# Altium schematic sheet Crosspoint.SchDoc: Cross-point
size A3; Author: M.Beldyga; CompanyName: WUT ISE; DrawnBy: M.Beldyga; Organization: WUT ISE; Address1: PW ISE; Address2: Nowowiejska 15/19 00-665 Warsaw; Address3: micbeldyga@gmail.com; SheetNumber: 2; SheetTotal: 8; ModifiedBy: -; CheckedDate: -; DivGrp: WUT ISE; Designer: M.Beldyga; ModifiedDate: -; ProjectName: Sensor Box
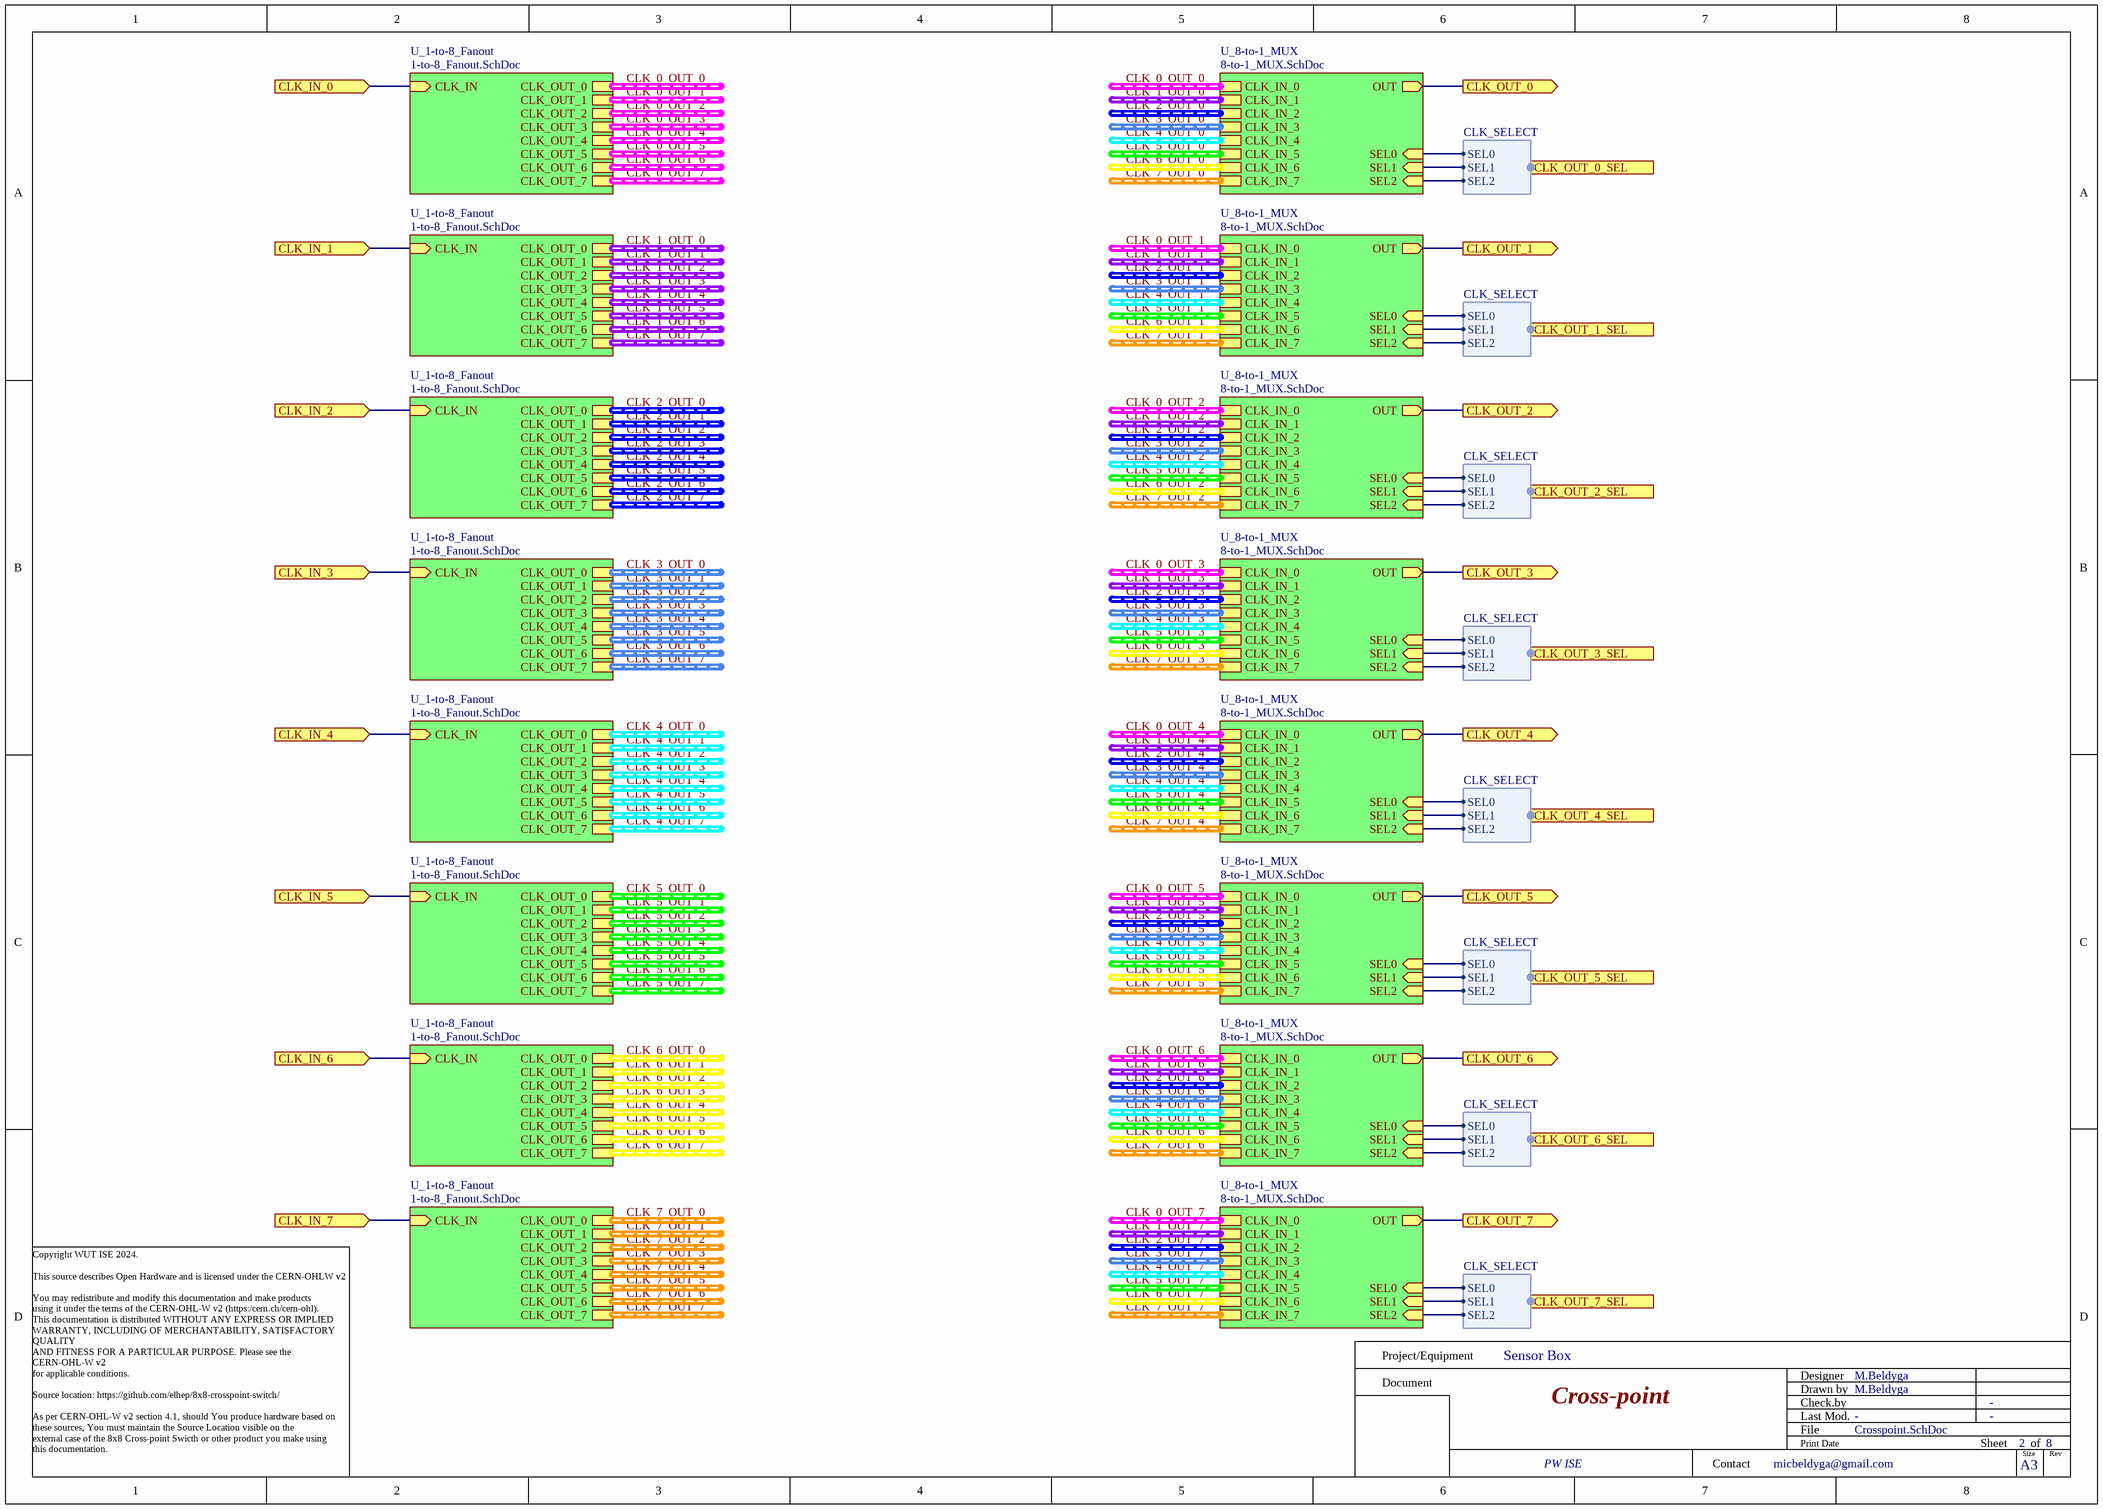
[diagram p0: Crosspoint.SchDoc]

## Sub-sheets
U_1-to-8_Fanout = 1-to-8_Fanout.SchDoc: CLK_IN (in), CLK_OUT_0 (harness DIFF_CLK), CLK_OUT_1 (harness DIFF_CLK), CLK_OUT_2 (harness DIFF_CLK), CLK_OUT_3 (harness DIFF_CLK), CLK_OUT_4 (harness DIFF_CLK), CLK_OUT_5 (harness DIFF_CLK), CLK_OUT_6 (harness DIFF_CLK), CLK_OUT_7 (harness DIFF_CLK)
U_1-to-8_Fanout = 1-to-8_Fanout.SchDoc: CLK_IN (in), CLK_OUT_0 (harness DIFF_CLK), CLK_OUT_1 (harness DIFF_CLK), CLK_OUT_2 (harness DIFF_CLK), CLK_OUT_3 (harness DIFF_CLK), CLK_OUT_4 (harness DIFF_CLK), CLK_OUT_5 (harness DIFF_CLK), CLK_OUT_6 (harness DIFF_CLK), CLK_OUT_7 (harness DIFF_CLK)
U_1-to-8_Fanout = 1-to-8_Fanout.SchDoc: CLK_IN (in), CLK_OUT_0 (harness DIFF_CLK), CLK_OUT_1 (harness DIFF_CLK), CLK_OUT_2 (harness DIFF_CLK), CLK_OUT_3 (harness DIFF_CLK), CLK_OUT_4 (harness DIFF_CLK), CLK_OUT_5 (harness DIFF_CLK), CLK_OUT_6 (harness DIFF_CLK), CLK_OUT_7 (harness DIFF_CLK)
U_1-to-8_Fanout = 1-to-8_Fanout.SchDoc: CLK_IN (in), CLK_OUT_0 (harness DIFF_CLK), CLK_OUT_1 (harness DIFF_CLK), CLK_OUT_2 (harness DIFF_CLK), CLK_OUT_3 (harness DIFF_CLK), CLK_OUT_4 (harness DIFF_CLK), CLK_OUT_5 (harness DIFF_CLK), CLK_OUT_6 (harness DIFF_CLK), CLK_OUT_7 (harness DIFF_CLK)
U_1-to-8_Fanout = 1-to-8_Fanout.SchDoc: CLK_IN (in), CLK_OUT_0 (harness DIFF_CLK), CLK_OUT_1 (harness DIFF_CLK), CLK_OUT_2 (harness DIFF_CLK), CLK_OUT_3 (harness DIFF_CLK), CLK_OUT_4 (harness DIFF_CLK), CLK_OUT_5 (harness DIFF_CLK), CLK_OUT_6 (harness DIFF_CLK), CLK_OUT_7 (harness DIFF_CLK)
U_1-to-8_Fanout = 1-to-8_Fanout.SchDoc: CLK_IN (in), CLK_OUT_0 (harness DIFF_CLK), CLK_OUT_1 (harness DIFF_CLK), CLK_OUT_2 (harness DIFF_CLK), CLK_OUT_3 (harness DIFF_CLK), CLK_OUT_4 (harness DIFF_CLK), CLK_OUT_5 (harness DIFF_CLK), CLK_OUT_6 (harness DIFF_CLK), CLK_OUT_7 (harness DIFF_CLK)
U_1-to-8_Fanout = 1-to-8_Fanout.SchDoc: CLK_IN (in), CLK_OUT_0 (harness DIFF_CLK), CLK_OUT_1 (harness DIFF_CLK), CLK_OUT_2 (harness DIFF_CLK), CLK_OUT_3 (harness DIFF_CLK), CLK_OUT_4 (harness DIFF_CLK), CLK_OUT_5 (harness DIFF_CLK), CLK_OUT_6 (harness DIFF_CLK), CLK_OUT_7 (harness DIFF_CLK)
U_1-to-8_Fanout = 1-to-8_Fanout.SchDoc: CLK_IN (in), CLK_OUT_0 (harness DIFF_CLK), CLK_OUT_1 (harness DIFF_CLK), CLK_OUT_2 (harness DIFF_CLK), CLK_OUT_3 (harness DIFF_CLK), CLK_OUT_4 (harness DIFF_CLK), CLK_OUT_5 (harness DIFF_CLK), CLK_OUT_6 (harness DIFF_CLK), CLK_OUT_7 (harness DIFF_CLK)
U_8-to-1_MUX = 8-to-1_MUX.SchDoc: SEL1 (in), SEL2 (in), SEL0 (in), OUT (out), CLK_IN_0 (harness DIFF_CLK), CLK_IN_1 (harness DIFF_CLK), CLK_IN_2 (harness DIFF_CLK), CLK_IN_3 (harness DIFF_CLK), CLK_IN_4 (harness DIFF_CLK), CLK_IN_5 (harness DIFF_CLK), CLK_IN_6 (harness DIFF_CLK), CLK_IN_7 (harness DIFF_CLK)
U_8-to-1_MUX = 8-to-1_MUX.SchDoc: SEL1 (in), SEL2 (in), SEL0 (in), OUT (out), CLK_IN_0 (harness DIFF_CLK), CLK_IN_1 (harness DIFF_CLK), CLK_IN_2 (harness DIFF_CLK), CLK_IN_3 (harness DIFF_CLK), CLK_IN_4 (harness DIFF_CLK), CLK_IN_5 (harness DIFF_CLK), CLK_IN_6 (harness DIFF_CLK), CLK_IN_7 (harness DIFF_CLK)
U_8-to-1_MUX = 8-to-1_MUX.SchDoc: SEL1 (in), SEL2 (in), SEL0 (in), OUT (out), CLK_IN_0 (harness DIFF_CLK), CLK_IN_1 (harness DIFF_CLK), CLK_IN_2 (harness DIFF_CLK), CLK_IN_3 (harness DIFF_CLK), CLK_IN_4 (harness DIFF_CLK), CLK_IN_5 (harness DIFF_CLK), CLK_IN_6 (harness DIFF_CLK), CLK_IN_7 (harness DIFF_CLK)
U_8-to-1_MUX = 8-to-1_MUX.SchDoc: SEL1 (in), SEL2 (in), SEL0 (in), OUT (out), CLK_IN_0 (harness DIFF_CLK), CLK_IN_1 (harness DIFF_CLK), CLK_IN_2 (harness DIFF_CLK), CLK_IN_3 (harness DIFF_CLK), CLK_IN_4 (harness DIFF_CLK), CLK_IN_5 (harness DIFF_CLK), CLK_IN_6 (harness DIFF_CLK), CLK_IN_7 (harness DIFF_CLK)
U_8-to-1_MUX = 8-to-1_MUX.SchDoc: SEL1 (in), SEL2 (in), SEL0 (in), OUT (out), CLK_IN_0 (harness DIFF_CLK), CLK_IN_1 (harness DIFF_CLK), CLK_IN_2 (harness DIFF_CLK), CLK_IN_3 (harness DIFF_CLK), CLK_IN_4 (harness DIFF_CLK), CLK_IN_5 (harness DIFF_CLK), CLK_IN_6 (harness DIFF_CLK), CLK_IN_7 (harness DIFF_CLK)
U_8-to-1_MUX = 8-to-1_MUX.SchDoc: SEL1 (in), SEL2 (in), SEL0 (in), OUT (out), CLK_IN_0 (harness DIFF_CLK), CLK_IN_1 (harness DIFF_CLK), CLK_IN_2 (harness DIFF_CLK), CLK_IN_3 (harness DIFF_CLK), CLK_IN_4 (harness DIFF_CLK), CLK_IN_5 (harness DIFF_CLK), CLK_IN_6 (harness DIFF_CLK), CLK_IN_7 (harness DIFF_CLK)
U_8-to-1_MUX = 8-to-1_MUX.SchDoc: SEL1 (in), SEL2 (in), SEL0 (in), OUT (out), CLK_IN_0 (harness DIFF_CLK), CLK_IN_1 (harness DIFF_CLK), CLK_IN_2 (harness DIFF_CLK), CLK_IN_3 (harness DIFF_CLK), CLK_IN_4 (harness DIFF_CLK), CLK_IN_5 (harness DIFF_CLK), CLK_IN_6 (harness DIFF_CLK), CLK_IN_7 (harness DIFF_CLK)
U_8-to-1_MUX = 8-to-1_MUX.SchDoc: SEL1 (in), SEL2 (in), SEL0 (in), OUT (out), CLK_IN_0 (harness DIFF_CLK), CLK_IN_1 (harness DIFF_CLK), CLK_IN_2 (harness DIFF_CLK), CLK_IN_3 (harness DIFF_CLK), CLK_IN_4 (harness DIFF_CLK), CLK_IN_5 (harness DIFF_CLK), CLK_IN_6 (harness DIFF_CLK), CLK_IN_7 (harness DIFF_CLK)

## Ports
CLK_IN_0 (in), CLK_IN_1 (in), CLK_IN_2 (in), CLK_IN_3 (in), CLK_IN_4 (in), CLK_IN_5 (in), CLK_IN_6 (in), CLK_IN_7 (in), CLK_OUT_0 (out), CLK_OUT_0_SEL (out, harness CLK_SELECT), CLK_OUT_1 (out), CLK_OUT_1_SEL (out, harness CLK_SELECT), CLK_OUT_2 (out), CLK_OUT_2_SEL (out, harness CLK_SELECT), CLK_OUT_3 (out), CLK_OUT_3_SEL (out, harness CLK_SELECT), CLK_OUT_4 (out), CLK_OUT_4_SEL (out, harness CLK_SELECT), CLK_OUT_5 (out), CLK_OUT_5_SEL (out, harness CLK_SELECT), CLK_OUT_6 (out), CLK_OUT_6_SEL (out, harness CLK_SELECT), CLK_OUT_7 (out), CLK_OUT_7_SEL (out, harness CLK_SELECT)

## Harnesses
CLK_SELECT: SEL0, SEL1, SEL2

## Nets
CLK_IN_0: port CLK_IN_0, sheet U_1-to-8_Fanout/CLK_IN
CLK_IN_1: port CLK_IN_1, sheet U_1-to-8_Fanout/CLK_IN
CLK_IN_2: port CLK_IN_2, sheet U_1-to-8_Fanout/CLK_IN
CLK_IN_3: port CLK_IN_3, sheet U_1-to-8_Fanout/CLK_IN
CLK_IN_4: port CLK_IN_4, sheet U_1-to-8_Fanout/CLK_IN
CLK_IN_5: port CLK_IN_5, sheet U_1-to-8_Fanout/CLK_IN
CLK_IN_6: port CLK_IN_6, sheet U_1-to-8_Fanout/CLK_IN
CLK_IN_7: port CLK_IN_7, sheet U_1-to-8_Fanout/CLK_IN
CLK_OUT_0: port CLK_OUT_0, sheet U_8-to-1_MUX/OUT
CLK_OUT_1: port CLK_OUT_1, sheet U_8-to-1_MUX/OUT
CLK_OUT_2: port CLK_OUT_2, sheet U_8-to-1_MUX/OUT
CLK_OUT_3: port CLK_OUT_3, sheet U_8-to-1_MUX/OUT
CLK_OUT_4: port CLK_OUT_4, sheet U_8-to-1_MUX/OUT
CLK_OUT_5: port CLK_OUT_5, sheet U_8-to-1_MUX/OUT
CLK_OUT_6: port CLK_OUT_6, sheet U_8-to-1_MUX/OUT
CLK_OUT_7: port CLK_OUT_7, sheet U_8-to-1_MUX/OUT
(unnamed): sheet U_8-to-1_MUX/SEL1, port CLK_OUT_0_SEL.SEL1
(unnamed): sheet U_8-to-1_MUX/SEL2, port CLK_OUT_0_SEL.SEL2
(unnamed): sheet U_8-to-1_MUX/SEL0, port CLK_OUT_0_SEL.SEL0
(unnamed): sheet U_8-to-1_MUX/SEL1, port CLK_OUT_1_SEL.SEL1
(unnamed): sheet U_8-to-1_MUX/SEL2, port CLK_OUT_1_SEL.SEL2
(unnamed): sheet U_8-to-1_MUX/SEL0, port CLK_OUT_1_SEL.SEL0
(unnamed): sheet U_8-to-1_MUX/SEL1, port CLK_OUT_2_SEL.SEL1
(unnamed): sheet U_8-to-1_MUX/SEL2, port CLK_OUT_2_SEL.SEL2
(unnamed): sheet U_8-to-1_MUX/SEL0, port CLK_OUT_2_SEL.SEL0
(unnamed): sheet U_8-to-1_MUX/SEL1, port CLK_OUT_3_SEL.SEL1
(unnamed): sheet U_8-to-1_MUX/SEL2, port CLK_OUT_3_SEL.SEL2
(unnamed): sheet U_8-to-1_MUX/SEL0, port CLK_OUT_3_SEL.SEL0
(unnamed): sheet U_8-to-1_MUX/SEL1, port CLK_OUT_4_SEL.SEL1
(unnamed): sheet U_8-to-1_MUX/SEL2, port CLK_OUT_4_SEL.SEL2
(unnamed): sheet U_8-to-1_MUX/SEL0, port CLK_OUT_4_SEL.SEL0
(unnamed): sheet U_8-to-1_MUX/SEL1, port CLK_OUT_5_SEL.SEL1
(unnamed): sheet U_8-to-1_MUX/SEL2, port CLK_OUT_5_SEL.SEL2
(unnamed): sheet U_8-to-1_MUX/SEL0, port CLK_OUT_5_SEL.SEL0
(unnamed): sheet U_8-to-1_MUX/SEL1, port CLK_OUT_6_SEL.SEL1
(unnamed): sheet U_8-to-1_MUX/SEL2, port CLK_OUT_6_SEL.SEL2
(unnamed): sheet U_8-to-1_MUX/SEL0, port CLK_OUT_6_SEL.SEL0
(unnamed): sheet U_8-to-1_MUX/SEL1, port CLK_OUT_7_SEL.SEL1
(unnamed): sheet U_8-to-1_MUX/SEL2, port CLK_OUT_7_SEL.SEL2
(unnamed): sheet U_8-to-1_MUX/SEL0, port CLK_OUT_7_SEL.SEL0

## Buses and harness runs
harness CLK_0_OUT_0 = sheet U_1-to-8_Fanout/CLK_OUT_0
harness CLK_0_OUT_0 = sheet U_8-to-1_MUX/CLK_IN_0
harness CLK_0_OUT_1 = sheet U_1-to-8_Fanout/CLK_OUT_1
harness CLK_0_OUT_1 = sheet U_8-to-1_MUX/CLK_IN_0
harness CLK_0_OUT_2 = sheet U_1-to-8_Fanout/CLK_OUT_2
harness CLK_0_OUT_2 = sheet U_8-to-1_MUX/CLK_IN_0
harness CLK_0_OUT_3 = sheet U_1-to-8_Fanout/CLK_OUT_3
harness CLK_0_OUT_3 = sheet U_8-to-1_MUX/CLK_IN_0
harness CLK_0_OUT_4 = sheet U_1-to-8_Fanout/CLK_OUT_4
harness CLK_0_OUT_4 = sheet U_8-to-1_MUX/CLK_IN_0
harness CLK_0_OUT_5 = sheet U_1-to-8_Fanout/CLK_OUT_5
harness CLK_0_OUT_5 = sheet U_8-to-1_MUX/CLK_IN_0
harness CLK_0_OUT_6 = sheet U_1-to-8_Fanout/CLK_OUT_6
harness CLK_0_OUT_6 = sheet U_8-to-1_MUX/CLK_IN_0
harness CLK_0_OUT_7 = sheet U_1-to-8_Fanout/CLK_OUT_7
harness CLK_0_OUT_7 = sheet U_8-to-1_MUX/CLK_IN_0
harness CLK_1_OUT_0 = sheet U_1-to-8_Fanout/CLK_OUT_0
harness CLK_1_OUT_0 = sheet U_8-to-1_MUX/CLK_IN_1
harness CLK_1_OUT_1 = sheet U_1-to-8_Fanout/CLK_OUT_1
harness CLK_1_OUT_1 = sheet U_8-to-1_MUX/CLK_IN_1
harness CLK_1_OUT_2 = sheet U_1-to-8_Fanout/CLK_OUT_2
harness CLK_1_OUT_2 = sheet U_8-to-1_MUX/CLK_IN_1
harness CLK_1_OUT_3 = sheet U_1-to-8_Fanout/CLK_OUT_3
harness CLK_1_OUT_3 = sheet U_8-to-1_MUX/CLK_IN_1
harness CLK_1_OUT_4 = sheet U_1-to-8_Fanout/CLK_OUT_4
harness CLK_1_OUT_4 = sheet U_8-to-1_MUX/CLK_IN_1
harness CLK_1_OUT_5 = sheet U_1-to-8_Fanout/CLK_OUT_5
harness CLK_1_OUT_5 = sheet U_8-to-1_MUX/CLK_IN_1
harness CLK_1_OUT_6 = sheet U_1-to-8_Fanout/CLK_OUT_6
harness CLK_1_OUT_6 = sheet U_8-to-1_MUX/CLK_IN_1
harness CLK_1_OUT_7 = sheet U_1-to-8_Fanout/CLK_OUT_7
harness CLK_1_OUT_7 = sheet U_8-to-1_MUX/CLK_IN_1
harness CLK_2_OUT_0 = sheet U_1-to-8_Fanout/CLK_OUT_0
harness CLK_2_OUT_0 = sheet U_8-to-1_MUX/CLK_IN_2
harness CLK_2_OUT_1 = sheet U_1-to-8_Fanout/CLK_OUT_1
harness CLK_2_OUT_1 = sheet U_8-to-1_MUX/CLK_IN_2
harness CLK_2_OUT_2 = sheet U_1-to-8_Fanout/CLK_OUT_2
harness CLK_2_OUT_2 = sheet U_8-to-1_MUX/CLK_IN_2
harness CLK_2_OUT_3 = sheet U_1-to-8_Fanout/CLK_OUT_3
harness CLK_2_OUT_3 = sheet U_8-to-1_MUX/CLK_IN_2
harness CLK_2_OUT_4 = sheet U_1-to-8_Fanout/CLK_OUT_4
harness CLK_2_OUT_4 = sheet U_8-to-1_MUX/CLK_IN_2
harness CLK_2_OUT_5 = sheet U_1-to-8_Fanout/CLK_OUT_5
harness CLK_2_OUT_5 = sheet U_8-to-1_MUX/CLK_IN_2
harness CLK_2_OUT_6 = sheet U_1-to-8_Fanout/CLK_OUT_6
harness CLK_2_OUT_6 = sheet U_8-to-1_MUX/CLK_IN_2
harness CLK_2_OUT_7 = sheet U_1-to-8_Fanout/CLK_OUT_7
harness CLK_2_OUT_7 = sheet U_8-to-1_MUX/CLK_IN_2
harness CLK_3_OUT_0 = sheet U_1-to-8_Fanout/CLK_OUT_0
harness CLK_3_OUT_0 = sheet U_8-to-1_MUX/CLK_IN_3
harness CLK_3_OUT_1 = sheet U_1-to-8_Fanout/CLK_OUT_1
harness CLK_3_OUT_1 = sheet U_8-to-1_MUX/CLK_IN_3
harness CLK_3_OUT_2 = sheet U_1-to-8_Fanout/CLK_OUT_2
harness CLK_3_OUT_2 = sheet U_8-to-1_MUX/CLK_IN_3
harness CLK_3_OUT_3 = sheet U_1-to-8_Fanout/CLK_OUT_3
harness CLK_3_OUT_3 = sheet U_8-to-1_MUX/CLK_IN_3
harness CLK_3_OUT_4 = sheet U_1-to-8_Fanout/CLK_OUT_4
harness CLK_3_OUT_4 = sheet U_8-to-1_MUX/CLK_IN_3
harness CLK_3_OUT_5 = sheet U_1-to-8_Fanout/CLK_OUT_5
harness CLK_3_OUT_5 = sheet U_8-to-1_MUX/CLK_IN_3
harness CLK_3_OUT_6 = sheet U_1-to-8_Fanout/CLK_OUT_6
harness CLK_3_OUT_6 = sheet U_8-to-1_MUX/CLK_IN_3
harness CLK_3_OUT_7 = sheet U_1-to-8_Fanout/CLK_OUT_7
harness CLK_3_OUT_7 = sheet U_8-to-1_MUX/CLK_IN_3
harness CLK_4_OUT_0 = sheet U_1-to-8_Fanout/CLK_OUT_0
harness CLK_4_OUT_0 = sheet U_8-to-1_MUX/CLK_IN_4
harness CLK_4_OUT_1 = sheet U_1-to-8_Fanout/CLK_OUT_1
harness CLK_4_OUT_1 = sheet U_8-to-1_MUX/CLK_IN_4
harness CLK_4_OUT_2 = sheet U_1-to-8_Fanout/CLK_OUT_2
harness CLK_4_OUT_2 = sheet U_8-to-1_MUX/CLK_IN_4
harness CLK_4_OUT_3 = sheet U_1-to-8_Fanout/CLK_OUT_3
harness CLK_4_OUT_3 = sheet U_8-to-1_MUX/CLK_IN_4
harness CLK_4_OUT_4 = sheet U_1-to-8_Fanout/CLK_OUT_4
harness CLK_4_OUT_4 = sheet U_8-to-1_MUX/CLK_IN_4
harness CLK_4_OUT_5 = sheet U_1-to-8_Fanout/CLK_OUT_5
harness CLK_4_OUT_5 = sheet U_8-to-1_MUX/CLK_IN_4
harness CLK_4_OUT_6 = sheet U_1-to-8_Fanout/CLK_OUT_6
harness CLK_4_OUT_6 = sheet U_8-to-1_MUX/CLK_IN_4
harness CLK_4_OUT_7 = sheet U_1-to-8_Fanout/CLK_OUT_7
harness CLK_4_OUT_7 = sheet U_8-to-1_MUX/CLK_IN_4
harness CLK_5_OUT_0 = sheet U_1-to-8_Fanout/CLK_OUT_0
harness CLK_5_OUT_0 = sheet U_8-to-1_MUX/CLK_IN_5
harness CLK_5_OUT_1 = sheet U_1-to-8_Fanout/CLK_OUT_1
harness CLK_5_OUT_1 = sheet U_8-to-1_MUX/CLK_IN_5
harness CLK_5_OUT_2 = sheet U_1-to-8_Fanout/CLK_OUT_2
harness CLK_5_OUT_2 = sheet U_8-to-1_MUX/CLK_IN_5
harness CLK_5_OUT_3 = sheet U_1-to-8_Fanout/CLK_OUT_3
harness CLK_5_OUT_3 = sheet U_8-to-1_MUX/CLK_IN_5
harness CLK_5_OUT_4 = sheet U_1-to-8_Fanout/CLK_OUT_4
harness CLK_5_OUT_4 = sheet U_8-to-1_MUX/CLK_IN_5
harness CLK_5_OUT_5 = sheet U_1-to-8_Fanout/CLK_OUT_5
harness CLK_5_OUT_5 = sheet U_8-to-1_MUX/CLK_IN_5
harness CLK_5_OUT_6 = sheet U_1-to-8_Fanout/CLK_OUT_6
harness CLK_5_OUT_6 = sheet U_8-to-1_MUX/CLK_IN_5
harness CLK_5_OUT_7 = sheet U_1-to-8_Fanout/CLK_OUT_7
harness CLK_5_OUT_7 = sheet U_8-to-1_MUX/CLK_IN_5
harness CLK_6_OUT_0 = sheet U_1-to-8_Fanout/CLK_OUT_0
harness CLK_6_OUT_0 = sheet U_8-to-1_MUX/CLK_IN_6
harness CLK_6_OUT_1 = sheet U_1-to-8_Fanout/CLK_OUT_1
harness CLK_6_OUT_1 = sheet U_8-to-1_MUX/CLK_IN_6
harness CLK_6_OUT_2 = sheet U_1-to-8_Fanout/CLK_OUT_2
harness CLK_6_OUT_2 = sheet U_8-to-1_MUX/CLK_IN_6
harness CLK_6_OUT_3 = sheet U_1-to-8_Fanout/CLK_OUT_3
harness CLK_6_OUT_3 = sheet U_8-to-1_MUX/CLK_IN_6
harness CLK_6_OUT_4 = sheet U_1-to-8_Fanout/CLK_OUT_4
harness CLK_6_OUT_4 = sheet U_8-to-1_MUX/CLK_IN_6
harness CLK_6_OUT_5 = sheet U_1-to-8_Fanout/CLK_OUT_5
harness CLK_6_OUT_5 = sheet U_8-to-1_MUX/CLK_IN_6
harness CLK_6_OUT_6 = sheet U_1-to-8_Fanout/CLK_OUT_6
harness CLK_6_OUT_6 = sheet U_8-to-1_MUX/CLK_IN_6
harness CLK_6_OUT_7 = sheet U_1-to-8_Fanout/CLK_OUT_7
harness CLK_6_OUT_7 = sheet U_8-to-1_MUX/CLK_IN_6
harness CLK_7_OUT_0 = sheet U_1-to-8_Fanout/CLK_OUT_0
harness CLK_7_OUT_0 = sheet U_8-to-1_MUX/CLK_IN_7
harness CLK_7_OUT_1 = sheet U_1-to-8_Fanout/CLK_OUT_1
harness CLK_7_OUT_1 = sheet U_8-to-1_MUX/CLK_IN_7
harness CLK_7_OUT_2 = sheet U_1-to-8_Fanout/CLK_OUT_2
harness CLK_7_OUT_2 = sheet U_8-to-1_MUX/CLK_IN_7
harness CLK_7_OUT_3 = sheet U_1-to-8_Fanout/CLK_OUT_3
harness CLK_7_OUT_3 = sheet U_8-to-1_MUX/CLK_IN_7
harness CLK_7_OUT_4 = sheet U_1-to-8_Fanout/CLK_OUT_4
harness CLK_7_OUT_4 = sheet U_8-to-1_MUX/CLK_IN_7
harness CLK_7_OUT_5 = sheet U_1-to-8_Fanout/CLK_OUT_5
harness CLK_7_OUT_5 = sheet U_8-to-1_MUX/CLK_IN_7
harness CLK_7_OUT_6 = sheet U_1-to-8_Fanout/CLK_OUT_6
harness CLK_7_OUT_6 = sheet U_8-to-1_MUX/CLK_IN_7
harness CLK_7_OUT_7 = sheet U_1-to-8_Fanout/CLK_OUT_7
harness CLK_7_OUT_7 = sheet U_8-to-1_MUX/CLK_IN_7

## Notes on the sheet
- Copyright WUT ISE 2024.
  This source describes Open Hardware and is licensed under the CERN-OHLW v2
  You may redistribute and modify this documentation and make products
  using it under the terms of the CERN-OHL-W v2 (https:/cern.ch/cern-ohl).
  This documentation is distributed WITHOUT ANY EXPRESS OR IMPLIED
  WARRANTY, INCLUDING OF MERCHANTABILITY, SATISFACTORY QUALITY
  AND FITNESS FOR A PARTICULAR PURPOSE. Please see the CERN-OHL-W v2
  for applicable conditions.
  Source location: https://github.com/elhep/8x8-crosspoint-switch/
  As per CERN-OHL-W v2 section 4.1, should You produce hardware based on
  these sources, You must maintain the Source Location visible on the
  external case of the 8x8 Cross-point Swicth or other product you make using
  this documentation.
- Project/Equipment
- Document
- Designer
- Drawn by
- Check.by
- Contact
- File
- Last Mod.
- Print Date
- Sheet
- Size
- A3
- of
- Rev